# Altium project ConnectorPCB.PrjPcb
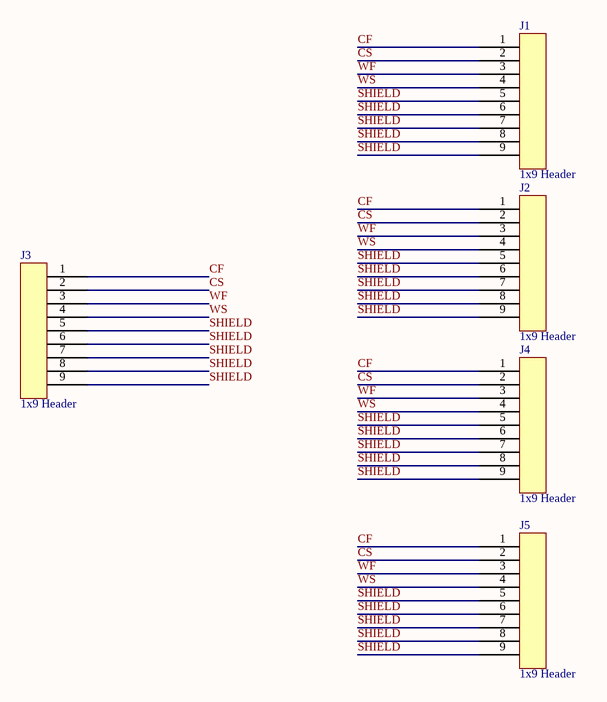
[diagram p0: Schematic.SchDoc]
1 sheet, 5 parts. Net scope: global (net labels, ports and power ports of the same name join across sheets).
Board file: 6C-2L-1550um.PcbDoc

## Sheet Schematic.SchDoc
size A3; SheetNumber: 1; SheetTotal: 1

### Parts
J1  1x9 Header  [D-SUB-9PIN-TE]
J2  1x9 Header  [D-SUB-9PIN-TE]
J3  1x9 Header  [D-SUB-9PIN-TE]
J4  1x9 Header  [D-SUB-9PIN-TE]
J5  1x9 Header  [D-SUB-9PIN-TE]

### Nets
CF: J1.1 J2.1 J3.1 J4.1 J5.1
CS: J1.2 J2.2 J3.2 J4.2 J5.2
SHIELD: J1.5 J1.6 J1.7 J1.8 J1.9 J2.5 J2.6 J2.7 J2.8 J2.9 J3.5 J3.6 J3.7 J3.8 J3.9 J4.5 J4.6 J4.7 J4.8 J4.9 J5.5 J5.6 J5.7 J5.8 J5.9
WF: J1.3 J2.3 J3.3 J4.3 J5.3
WS: J1.4 J2.4 J3.4 J4.4 J5.4